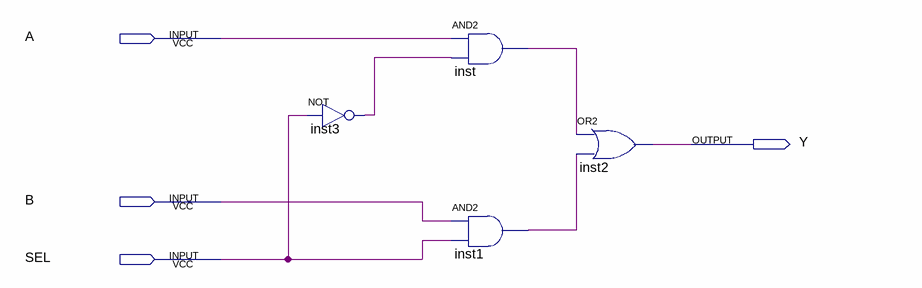
[diagram p0: schematic sheet]
// Quartus schematic MUX21.bdf as structural Verilog: 4 symbols, 4 pins
module MUX21 (
  input  A,
  input  B,
  input  SEL,
  output Y
);

  wire inst1_out, inst3_out, inst_out;

  not inst3 (inst3_out, SEL);
  and inst (inst_out, A, inst3_out);
  and inst1 (inst1_out, B, SEL);
  or inst2 (Y, inst_out, inst1_out);
endmodule
